# Altium schematic sheet Sheet3-renamed.SchDoc
size A; SheetNumber: 3; SheetTotal: 3
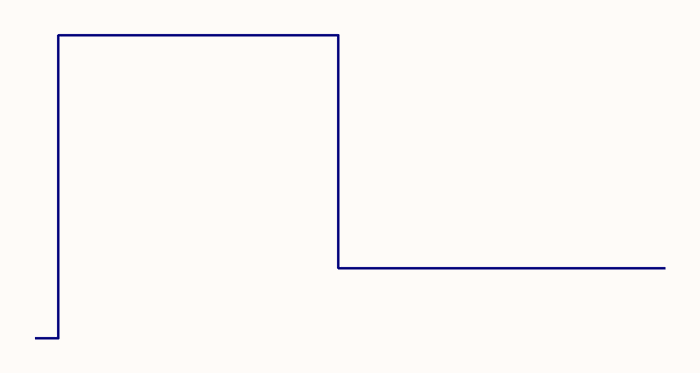
[diagram p0: Sheet3-renamed.SchDoc]